# Altium schematic sheet STM32Fx.SchDoc: STM32F429ZIT6 MCU
size A4; DocumentNumber: 5; SheetNumber: 5; SheetTotal: 7
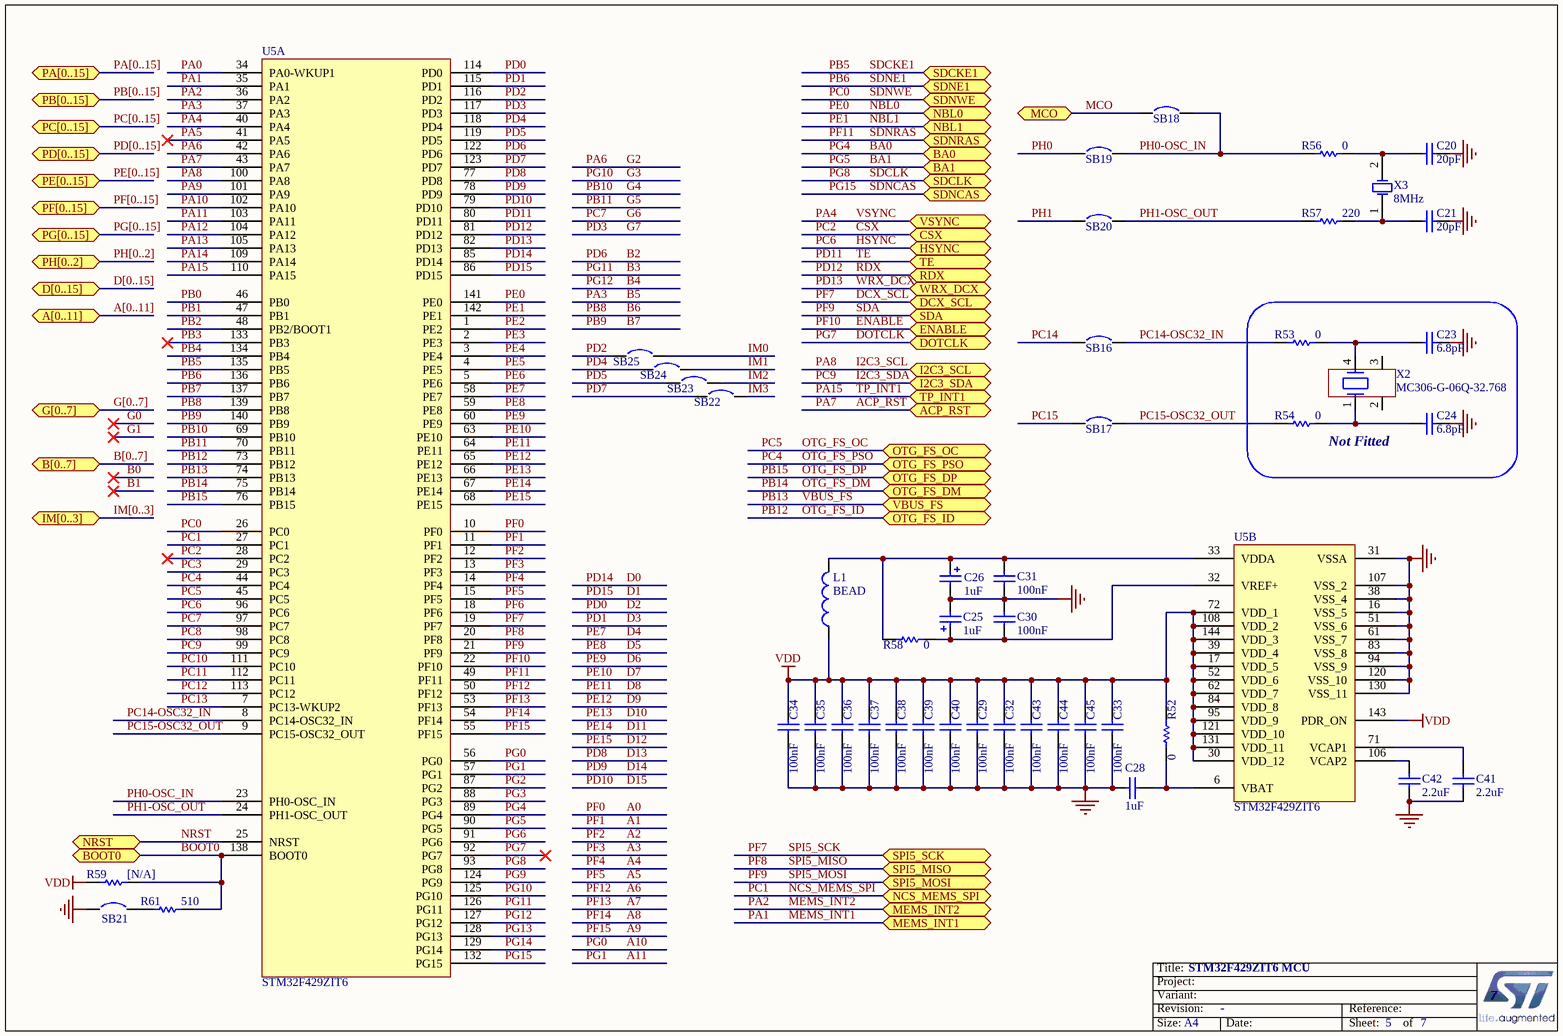
[diagram p0: STM32Fx.SchDoc]

## Parts
C20  20pF  [0402C]
C21  20pF  [0402C]
C23  6.8pF  [0402C]
C24  6.8pF  [0402C]
C25  1uF  [TAN-A]
C26  1uF  [TAN-A]
C28  1uF  [0603C]
C29  100nF  [0402C]
C30  100nF  [0402C]
C31  100nF  [0402C]
C32  100nF  [0402C]
C33  100nF  [0402C]
C34  100nF  [0402C]
C35  100nF  [0402C]
C36  100nF  [0402C]
C37  100nF  [0402C]
C38  100nF  [0402C]
C39  100nF  [0402C]
C40  100nF  [0402C]
C41  2.2uF  [TAN-A]
C42  2.2uF  [TAN-A]
C43  100nF  [0402C]
C44  100nF  [0402C]
C45  100nF  [0402C]
L1  BEAD  [0603L]
R52  0  [0402R]
R53  0  [0402R]
R54  0  [0402R]
R56  0  [0402R]
R57  220  [0402R]
R58  0  [0402R]
R59  [N/A]  [0402R]
R61  510  [0402R]
SB16  Circuit Breaker  [JP2_SMD]  (value not drawn)
SB17  Circuit Breaker  [JP2_SMD]  (value not drawn)
SB18  Circuit Breaker  [JP2_SMD]  (value not drawn)
SB19  Circuit Breaker  [JP2_SMD]  (value not drawn)
SB20  Circuit Breaker  [JP2_SMD]  (value not drawn)
SB21  Circuit Breaker  [JP2_SMD]  (value not drawn)
SB22  Circuit Breaker  [JP2_SMD]  (value not drawn)
SB23  Circuit Breaker  [JP2_SMD]  (value not drawn)
SB24  Circuit Breaker  [JP2_SMD]  (value not drawn)
SB25  Circuit Breaker  [JP2_SMD]  (value not drawn)
U5  STM32F429ZIT6  [TQFP144]  (parts A,B of 2)
X2  MC306-G-06Q-32.768  [MC306-CRYSTAL]
X3  8MHz  [XTAL1]

## Blocks framed on the sheet
Not Fitted: C23 C24 R53 R54 X2

## Ports
A[0..11], ACP_RST, B[0..7], BA0, BA1, BOOT0, CSX, D[0..15], DCX_SCL, DOTCLK, ENABLE, G[0..7], HSYNC, I2C3_SCL, I2C3_SDA, IM[0..3], MCO, MEMS_INT1, MEMS_INT2, NBL0, NBL1, NCS_MEMS_SPI, NRST, OTG_FS_DM, OTG_FS_DP, OTG_FS_ID, OTG_FS_OC, OTG_FS_PSO, PA[0..15], PB[0..15], PC[0..15], PD[0..15], PE[0..15], PF[0..15], PG[0..15], PH[0..2], RDX, SDA, SDCKE1, SDCLK, SDNCAS, SDNE1, SDNRAS, SDNWE, SPI5_MISO, SPI5_MOSI, SPI5_SCK, TE, TP_INT1, VBUS_FS, VSYNC, WRX_DCX

## Nets
GND: C20.2 C21.2 C23.2 C24.2 C25.2 C26.2 C28.1 C29.1 C30.2 C31.1 C32.1 C33.1 C34.1 C35.1 C36.1 C37.1 C38.1 C39.1 C40.1 C41.2 C42.2 C43.1 C44.1 C45.1 SB21.1 U5.16(VSS_5) U5.31(VSSA) U5.38(VSS_4) U5.51(VSS_6) U5.61(VSS_7) U5.83(VSS_8) U5.94(VSS_9) U5.107(VSS_2) U5.120(VSS_10) U5.130(VSS_11)
VDD: C29.2 C32.2 C33.2 C34.2 C35.2 C36.2 C37.2 C38.2 C39.2 C40.2 C43.2 C44.2 C45.2 L1.1 R52.2 R59.1 U5.17(VDD_5) U5.30(VDD_12) U5.39(VDD_4) U5.52(VDD_6) U5.62(VDD_7) U5.72(VDD_1) U5.84(VDD_8) U5.95(VDD_9) U5.108(VDD_2) U5.121(VDD_10) U5.131(VDD_11) U5.143(PDR_ON) U5.144(VDD_3)
A0: U5.10(PF0)  [also labelled PF0]
A1: U5.11(PF1)  [also labelled PF1]
A2: U5.12(PF2)  [also labelled PF2]
A3: U5.13(PF3)  [also labelled PF3]
A4: U5.14(PF4)  [also labelled PF4]
A5: U5.15(PF5)  [also labelled PF5]
A6: U5.50(PF12)  [also labelled PF12]
A7: U5.53(PF13)  [also labelled PF13]
A8: U5.54(PF14)  [also labelled PF14]
A9: U5.55(PF15)  [also labelled PF15]
A10: U5.56(PG0)  [also labelled PG0]
A11: U5.57(PG1)  [also labelled PG1]
ACP_RST: U5.43(PA7) ; port ACP_RST  [also labelled PA7]
B2: U5.122(PD6)  [also labelled PD6]
B3: U5.126(PG11)  [also labelled PG11]
B4: U5.127(PG12)  [also labelled PG12]
B5: U5.37(PA3)  [also labelled PA3]
B6: U5.139(PB8)  [also labelled PB8]
B7: U5.140(PB9)  [also labelled PB9]
BA0: U5.89(PG4) ; port BA0  [also labelled PG4]
BA1: U5.90(PG5) ; port BA1  [also labelled PG5]
BOOT0: R59.2 R61.2 U5.138(BOOT0) ; port BOOT0
CSX: U5.28(PC2) ; port CSX  [also labelled PC2]
D0: U5.85(PD14)  [also labelled PD14]
D1: U5.86(PD15)  [also labelled PD15]
D2: U5.114(PD0)  [also labelled PD0]
D3: U5.115(PD1)  [also labelled PD1]
D4: U5.58(PE7)  [also labelled PE7]
D5: U5.59(PE8)  [also labelled PE8]
D6: U5.60(PE9)  [also labelled PE9]
D7: U5.63(PE10)  [also labelled PE10]
D8: U5.64(PE11)  [also labelled PE11]
D9: U5.65(PE12)  [also labelled PE12]
D10: U5.66(PE13)  [also labelled PE13]
D11: U5.67(PE14)  [also labelled PE14]
D12: U5.68(PE15)  [also labelled PE15]
D13: U5.77(PD8)  [also labelled PD8]
D14: U5.78(PD9)  [also labelled PD9]
D15: U5.79(PD10)  [also labelled PD10]
DCX_SCL: U5.19(PF7) ; port DCX_SCL, port SPI5_SCK  [also labelled PF7, SPI5_SCK]
DOTCLK: U5.92(PG7) ; port DOTCLK  [also labelled PG7]
ENABLE: U5.22(PF10) ; port ENABLE  [also labelled PF10]
G2: U5.42(PA6)  [also labelled PA6]
G3: U5.125(PG10)  [also labelled PG10]
G4: U5.69(PB10)  [also labelled PB10]
G5: U5.70(PB11)  [also labelled PB11]
G6: U5.97(PC7)  [also labelled PC7]
G7: U5.117(PD3)  [also labelled PD3]
HSYNC: U5.96(PC6) ; port HSYNC  [also labelled PC6]
I2C3_SCL: U5.100(PA8) ; port I2C3_SCL  [also labelled PA8]
I2C3_SDA: U5.99(PC9) ; port I2C3_SDA  [also labelled PC9]
IM0: SB25.2
IM1: SB24.2
IM2: SB23.2
IM3: SB22.2
MCO: SB18.1 ; port MCO
MEMS_INT1: U5.35(PA1) ; port MEMS_INT1  [also labelled PA1]
MEMS_INT2: U5.36(PA2) ; port MEMS_INT2  [also labelled PA2]
NBL0: U5.141(PE0) ; port NBL0  [also labelled PE0]
NBL1: U5.142(PE1) ; port NBL1  [also labelled PE1]
NCS_MEMS_SPI: U5.27(PC1) ; port NCS_MEMS_SPI  [also labelled PC1]
NRST: U5.25(NRST) ; port NRST
OTG_FS_DM: U5.75(PB14) ; port OTG_FS_DM  [also labelled PB14]
OTG_FS_DP: U5.76(PB15) ; port OTG_FS_DP  [also labelled PB15]
OTG_FS_ID: U5.73(PB12) ; port OTG_FS_ID  [also labelled PB12]
OTG_FS_OC: U5.45(PC5) ; port OTG_FS_OC  [also labelled PC5]
OTG_FS_PSO: U5.44(PC4) ; port OTG_FS_PSO  [also labelled PC4]
PA0: U5.34(PA0-WKUP1)
PA4: U5.40(PA4) ; port VSYNC  [also labelled VSYNC]
PA5: U5.41(PA5)
PA9: U5.101(PA9)
PA10: U5.102(PA10)
PA11: U5.103(PA11)
PA12: U5.104(PA12)
PA13: U5.105(PA13)
PA14: U5.109(PA14)
PA15: U5.110(PA15) ; port TP_INT1  [also labelled TP_INT1]
PB0: U5.46(PB0)
PB1: U5.47(PB1)
PB2: U5.48(PB2/BOOT1)
PB3: U5.133(PB3)
PB4: U5.134(PB4)
PB5: U5.135(PB5) ; port SDCKE1  [also labelled SDCKE1]
PB6: U5.136(PB6) ; port SDNE1  [also labelled SDNE1]
PB7: U5.137(PB7)
PB13: U5.74(PB13) ; port VBUS_FS  [also labelled VBUS_FS]
PC0: U5.26(PC0) ; port SDNWE  [also labelled SDNWE]
PC3: U5.29(PC3)
PC8: U5.98(PC8)
PC10: U5.111(PC10)
PC11: U5.112(PC11)
PC12: U5.113(PC12)
PC13: U5.7(PC13-WKUP2)
PC14: SB16.1
PC14-OSC32_IN: R53.1 SB16.2 U5.8(PC14-OSC32_IN)
PC15: SB17.1
PC15-OSC32_OUT: R54.1 SB17.2 U5.9(PC15-OSC32_OUT)
PD2: SB25.1 U5.116(PD2)
PD4: SB24.1 U5.118(PD4)
PD5: SB23.1 U5.119(PD5)
PD7: SB22.1 U5.123(PD7)
PD11: U5.80(PD11) ; port TE  [also labelled TE]
PD12: U5.81(PD12) ; port RDX  [also labelled RDX]
PD13: U5.82(PD13) ; port WRX_DCX  [also labelled WRX_DCX]
PE2: U5.1(PE2)
PE3: U5.2(PE3)
PE4: U5.3(PE4)
PE5: U5.4(PE5)
PE6: U5.5(PE6)
PF6: U5.18(PF6)
PF8: U5.20(PF8) ; port SPI5_MISO  [also labelled SPI5_MISO]
PF9: U5.21(PF9) ; port SDA, port SPI5_MOSI  [also labelled SDA, SPI5_MOSI]
PF11: U5.49(PF11) ; port SDNRAS  [also labelled SDNRAS]
PG2: U5.87(PG2)
PG3: U5.88(PG3)
PG6: U5.91(PG6)
PG8: U5.93(PG8) ; port SDCLK  [also labelled SDCLK]
PG9: U5.124(PG9)
PG13: U5.128(PG13)
PG14: U5.129(PG14)
PG15: U5.132(PG15) ; port SDNCAS  [also labelled SDNCAS]
PH0: SB19.1
PH0-OSC_IN: R56.1 SB18.2 SB19.2 U5.23(PH0-OSC_IN)
PH1: SB20.1
PH1-OSC_OUT: R57.1 SB20.2 U5.24(PH1-OSC_OUT)
NetC20_1: C20.1 R56.2 X3.2(OSC2)
NetC21_1: C21.1 R57.2 X3.1(OSC1)
NetC23_1: C23.1 R53.2 X2.4
NetC24_1: C24.1 R54.2 X2.1
NetC25_1: C25.1 C30.1 R58.2 U5.32(VREF+)
NetC26_1: C26.1 C31.2 L1.2 R58.1 U5.33(VDDA)
NetC28_2: C28.2 R52.1 U5.6(VBAT)
NetC41_1: C41.1 U5.71(VCAP1)
NetC42_1: C42.1 U5.106(VCAP2)
NetR61_1: R61.1 SB21.2

Not connected (* = marked no-connect by the designer): X2 2 3

## Buses and harness runs
bus A[0..11] = port A[0..11]
bus B[0..7] = port B[0..7]
bus D[0..15] = port D[0..15]
bus G[0..7] = port G[0..7]
bus IM[0..3] = port IM[0..3]
bus PA[0..15] = port PA[0..15]
bus PB[0..15] = port PB[0..15]
bus PC[0..15] = port PC[0..15]
bus PD[0..15] = port PD[0..15]
bus PE[0..15] = port PE[0..15]
bus PF[0..15] = port PF[0..15]
bus PG[0..15] = port PG[0..15]
bus PH[0..2] = port PH[0..2]

## Notes on the sheet
- Title:
- Project:
- Size:
- Revision:
- Variant:
- A4
- -
- Date:
- Reference:
- Sheet:
- of

## Library data of the parts
C20 C21 C28 = Capacitor_ST: Capacitor 0402 / 0603 / 0805; Value: 100nF; Revision: July-2002: Re-released for DXP Platform.
C23 C24 = Capacitor_ST: Capacitor 0402 / 0603 / 0805; Value: 100nF; Fitted: NO; Revision: July-2002: Re-released for DXP Platform.
C25 C26 = Cap Pol1: Polarized Capacitor (Radial); Value: 10uF; Published: 8-Jun-2000; Revision: July-2002: Re-released for DXP Platform.; Publisher: Altium Limited
C29-C40 C43-C45 = Capacitor_ST: Capacitor 0402 / 0603 / 0805; Revision: July-2002: Re-released for DXP Platform.; Value: 100nF
C41 C42 = Cap Low ESR: Low ESR Ceramic Capacitor (X7R); Order: CC1206KKX7R7BB225; Revision: July-2002: Re-released for DXP Platform.; Value: 2.2uF; Distrib: FARNELL; Manuf_Part_1: CC1206KKX7R7BB225; Manuf_1: www.yageo.com
L1 = Inductor: Manuf_Part_1: FCM1608KF-601T03; Value: 100uH; Published: 8-Jun-2000; Revision: July-2002: Re-released for DXP Platform.; Publisher: Altium Limited; Order: FCM1608KF-601T03
R52 R56-R58 R61 = Resistor_ST: Resistor 0402 / 0603 / 0805; Value: 10K
R53 R54 R59 = Resistor_ST: Resistor 0402 / 0603 / 0805; Value: 10K; Fitted: NO
SB16-SB18 SB20 SB21 = Circuit Breaker: Solder: YES; Published: 24-Mar-1999; Revision: July-2002: Re-released for DXP Platform.; Publisher: Altium Limited
SB19 SB22-SB25 = Circuit Breaker: Solder: NO; Published: 24-Mar-1999; Revision: July-2002: Re-released for DXP Platform.; Publisher: Altium Limited
U5 = STM32F429ZIT6U: STM32 Big Manta (STM32F429ZIT6U); Manuf_1: STM; Provided: ST; Ref St: 9175122; ECCN_US/EU: 3A991A2/NEC; Distrib: ST; Footprint: QFP144; Order: STM32F429ZIT6U; Manuf_Part_1: STM32F429ZIT6U
X2 = XTAL_32K: Crystal oscillator for clock,32.768K,6PF,20PPM,-40~85 degree,SMT; Manuf_Part_1: ETMB32.768W060BMPF; Manuf_1: JFVNY; Fitted: NO
X3 = XTAL: Crystal Oscillator,8Mhz,20PF,20PPM,-10-70 degree,DIP,HC-49S; Manuf_Part_1: 9SL8000020AFXHF0; Order: 9SL8000020AFXHF0